# Altium schematic sheet 04 LED.SchDoc
size 420 x 297 mm
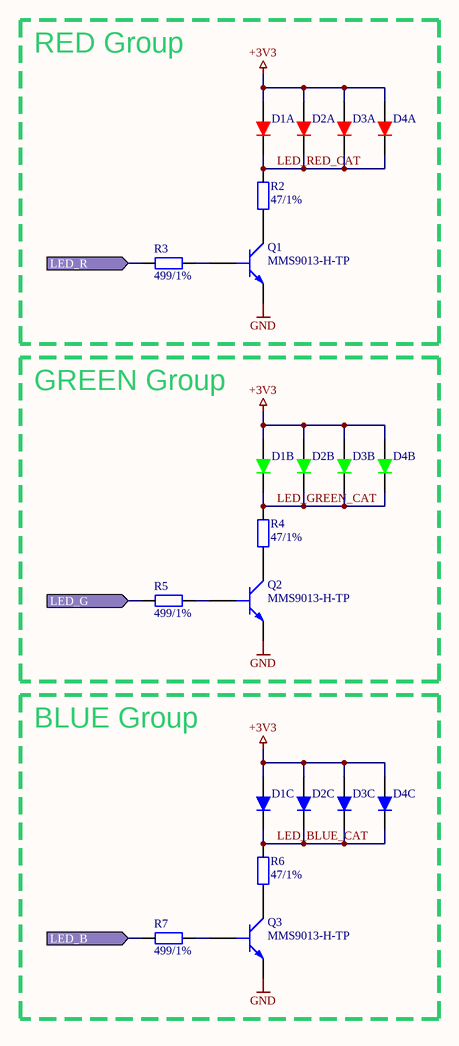
[diagram p0: 04 LED.SchDoc]

## Parts
D1  NH-B2020RGBA-HF  [NH-B2020RGBA-HF]  (value not drawn)  (parts A,B,C of 3)
D2  NH-B2020RGBA-HF  [NH-B2020RGBA-HF]  (value not drawn)  (parts A,B,C of 3)
D3  NH-B2020RGBA-HF  [NH-B2020RGBA-HF]  (value not drawn)  (parts A,B,C of 3)
D4  NH-B2020RGBA-HF  [NH-B2020RGBA-HF]  (value not drawn)  (parts A,B,C of 3)
Q1  MMS9013-H-TP  [SOT95P237X110-3N]
Q2  MMS9013-H-TP  [SOT95P237X110-3N]
Q3  MMS9013-H-TP  [SOT95P237X110-3N]
R2  47/1%  [RESC1005X04N]
R3  499/1%  [RESC1005X04N]
R4  47/1%  [RESC1005X04N]
R5  499/1%  [RESC1005X04N]
R6  47/1%  [RESC1005X04N]
R7  499/1%  [RESC1005X04N]

## Blocks framed on the sheet
RED Group: D1-D4 Q1 R2 R3
GREEN Group: D1-D4 Q2 R4 R5
BLUE Group: D1-D4 Q3 R6 R7

## Ports
LED_B (in), LED_G (in), LED_R (in)

## Nets
+3V3: D1.3 D2.3 D3.3 D4.3
GND: Q1.2 Q2.2 Q3.2
LED_B: R7.2 ; port LED_B
LED_BLUE_CAT: D1.2 D2.2 D3.2 D4.2 R6.2
LED_G: R5.2 ; port LED_G
LED_GREEN_CAT: D1.4 D2.4 D3.4 D4.4 R4.2
LED_R: R3.2 ; port LED_R
LED_RED_CAT: D1.1 D2.1 D3.1 D4.1 R2.2
NetQ1_1: Q1.1 R3.1
NetQ1_3: Q1.3 R2.1
NetQ2_1: Q2.1 R5.1
NetQ2_3: Q2.3 R4.1
NetQ3_1: Q3.1 R7.1
NetQ3_3: Q3.3 R6.1

## Notes on the sheet
- Title
- Project
- Size
- Date
- Revision
- A3

## Library data of the parts
D1-D4 = NH-B2020RGBA-HF: -30℃~+85℃ Common anode RGB 110° SMD,2.1x2.1mm  Light Emitting Diodes (LED) ROHS; manufacturer: Foshan NationStar Optoelectronics; assembler_number: C2874116; mfr_part_number: NH-B2020RGBA-HF; datasheet: https://datasheet.lcsc.com/lcsc/2108150330_Foshan-NationStar-Optoelectronics-NH-B2020RGBA-HF_C2874116.pdf
Q1-Q3 = MMS9013-H-TP: manufacturer: MCC(Micro Commercial Components); assembler_number: C90160; mfr_part_number: MMS9013-H-TP; datasheet: https://datasheet.lcsc.com/lcsc/1912112237_MCC-Micro-Commercial-Components-MMS9013-H-TP_C90160.pdf
R2 R4 R6 = RCT0247RJLF: 62.5mW ±5% 47Ω 0402  Chip Resistor - Surface Mount ROHS; manufacturer: HKR(Hong Kong Resistors); assembler_number: C174246; mfr_part_number: RCT0247RJLF; datasheet: https://datasheet.lcsc.com/lcsc/1810251713_HKR-Hong-Kong-Resistors-RCT0247RJLF_C174246.pdf
R3 R5 R7 = RC0402FR-07499RL: 62.5mW Thick Film Resistors 50V ±100ppm/℃ ±1% -55℃~+155℃ 499Ω 0402  Chip Resistor - Surface Mount ROHS; manufacturer: YAGEO; assembler_number: C137970; mfr_part_number: RC0402FR-07499RL; datasheet: https://datasheet.lcsc.com/lcsc/1810241332_YAGEO-RC0402FR-07499RL_C137970.pdf